# EAGLE design GBASP USB-C (EAGLE 6.2)
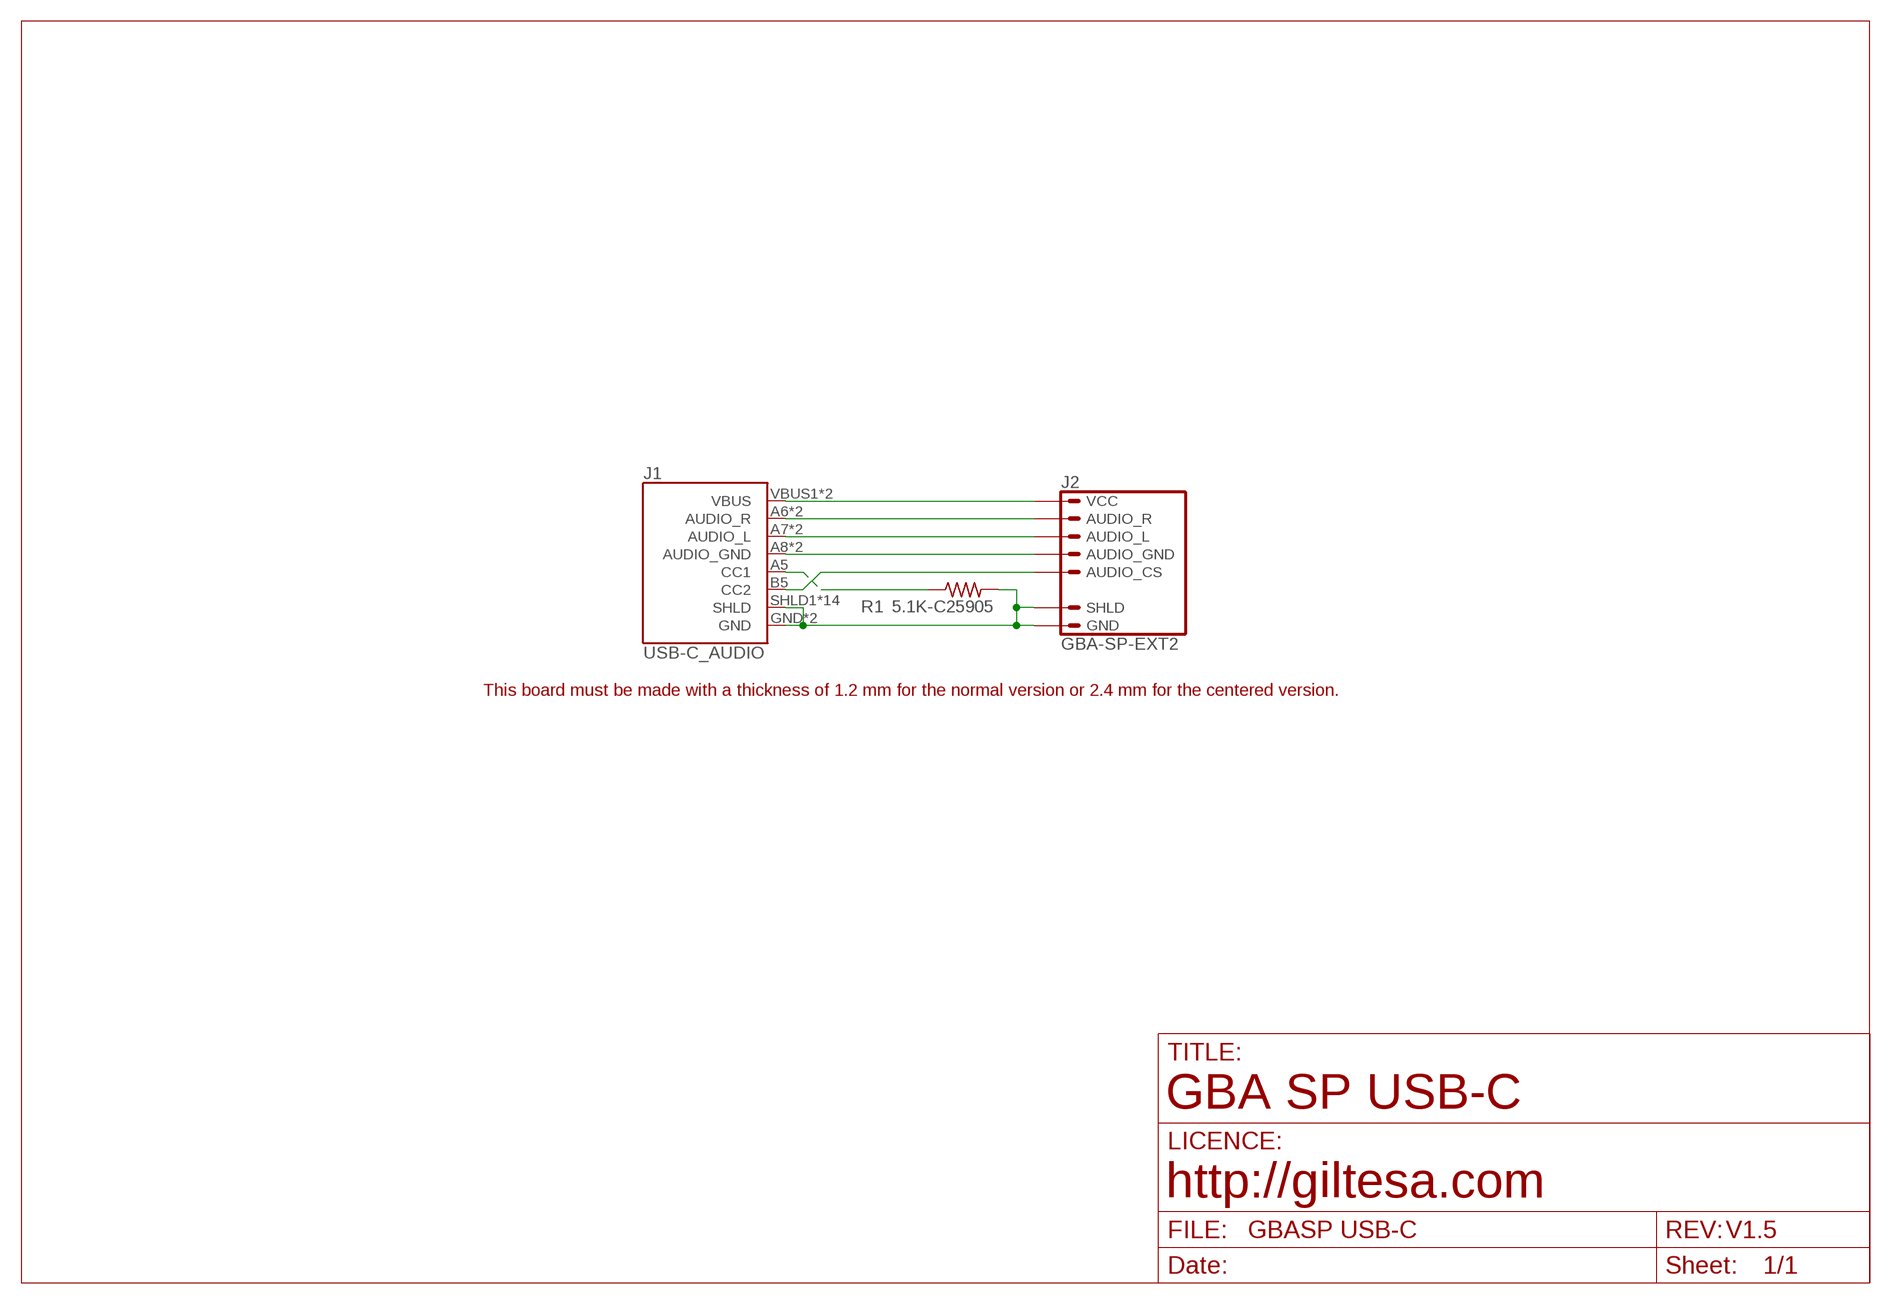
[diagram p0: schematic, sheet 1]

## Parts
J1  USB-C_AUDIO  USB-C_POWER_AUDIOGBASP_DRILL  [USB-C_16P_3SHLD_DRILL]
J2  GBA-SP-EXT2  GBA-SP-EXT2_1  [GBA-SP-EXT2_1]
R1  5.1K-C25905  R0402  [R0402]

## Nets
AUDIO_GND: J1.A8(AUDIO_GND) J1.B8(AUDIO_GND) J2.AUDIO_GND
AUDIO_L: J1.A7(AUDIO_L) J1.B7(AUDIO_L) J2.AUDIO_L
AUDIO_R: J1.A6(AUDIO_R) J1.B6(AUDIO_R) J2.AUDIO_R
CC2: J1.B5(CC2) J2.AUDIO_CS
GND: J1.GND J1.GND2(GND) J1.SHLD1(SHLD) J1.SHLD1_2(SHLD) J1.SHLD3(SHLD) J1.SHLD3_2(SHLD) J1.SHLD4(SHLD) J1.SHLD4_2(SHLD) J1.SHLD5(SHLD) J1.SHLD5_2(SHLD) J1.SHLD6(SHLD) J1.SHLD6_2(SHLD) J1.SHLD7(SHLD) J1.SHLD7_2(SHLD) J1.SHLD8(SHLD) J1.SHLD8_2(SHLD) J2.GND J2.SHLD1(SHLD) J2.SHLD2(SHLD) J2.SHLD3(SHLD) J2.SHLD4(SHLD) R1.2
N$7: J1.A5(CC1) R1.1
VCC: J1.VBUS1(VBUS) J1.VBUS2(VBUS) J2.VCC

## Notes on the sheet
- This board must be made with a thickness of 1.2 mm for the normal version or 2.4 mm for the centered version.
- GBA SP USB-C
- http://giltesa.com
- V1.5

## Library data of the parts
J1 = ,giltesa:USB-C_POWER_AUDIO
J2 = ,giltesa:GBA-SP-EXT2
R1 = ,giltesa:R0402

## Net classes
1 power: width 0.61 mm, drill 0.406 mm, clearance 0.203 mm
2 gnd: width 0.305 mm, drill 0.406 mm, clearance 0.203 mm
3 power usb: width 0.508 mm, drill 0.406 mm, clearance 0.203 mm

## Board
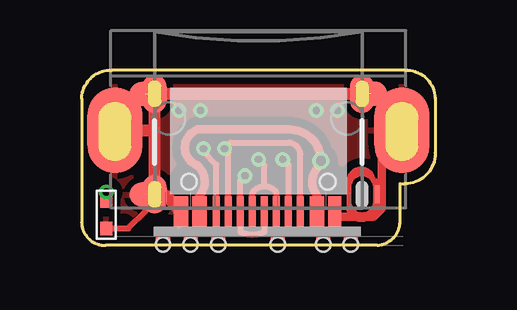
[diagram p1: board, top side]
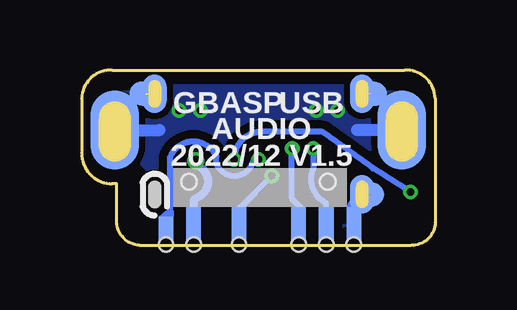
[diagram p2: board, bottom side, seen from below]

Size 14.73 x 7.3 mm. Coordinates in mm from the lower left corner, seen from the top.
Outline: 12.32,0 arc90 13.27,1.07 13.27,2.57 13.46,2.57 arc90 14.73,3.84 14.73,6.12 arc90 13.46,7.3 1.27,7.3 arc90 0,6.12 0,0.94 arc90 1,0 12.32,0
Copper layers (1*16): Top 0.035mm / dielectric 1.6mm / Bottom 0.035mm
Design rules: minimum track width 6mil, minimum drill 12mil, track to track 6mil, track to pad 6mil, pad to pad 6mil, via to via 8mil, smd to smd 0mil, copper to edge 20mil, drill to drill 10mil, minimum pad ring 6mil, minimum via ring 6mil, stop-mask expansion 0mil, vias tented up to drill 100mil, thermal gap 10mil
tRestrict: 6 lines
bRestrict: area 3,0.7 to 3.1,1.2; 2 lines

### Footprints (pad centres in the part's own frame; a part is rotated, then mirrored left to right if it is on the bottom)
USB-C_16P_3SHLD_DRILL = smd 0.3 x 1.27: A5 -1.25,0.132; A6 -0.25,0.132; A7 0.25,0.132; A8 1.25,0.132; B5 1.75,0.132; B6 0.75,0.132; B7 -0.75,0.132; B8 -1.75,0.132 | smd 0.533 x 1.27: GND -3.184,0.132 | smd 0.6 x 1.27: GND2 3.225,0.132; VBUS1 -2.45,0.132; VBUS2 2.45,0.132 | smd 0.2 x 0.75: SHLD1 -4.95,-0.57; SHLD1_2 -4.95,-0.57 | smd 1 x 1.6: SHLD3 4.32,-0.57; SHLD5 4.32,-4.761; SHLD7 -4.32,-4.764 | smd 1.346 x 1: SHLD3_2 4.688,-0.567; SHLD5_2 4.688,-4.758; SHLD7_2 -4.688,-4.768 | smd 1 x 1.6 bottom: SHLD4 4.32,-0.57; SHLD6 4.32,-4.761; SHLD8 -4.32,-4.764 | smd 1.346 x 1 bottom: SHLD4_2 4.561,-0.567; SHLD6_2 4.688,-4.758; SHLD8_2 -4.688,-4.768 | hole 0.635: -2.89,-1.1; 2.89,-1.1 | hole 0.432: -4.32,-0.878; -4.32,-0.269; -4.32,-0.472; -4.32,-0.675; -4.32,-0.37; -4.32,-0.777; -4.32,-0.574
GBA-SP-EXT2_1 = smd 0.61 x 1.651 bottom: AUDIO_CS -2.826,-0.797; AUDIO_GND -1.676,-0.797; AUDIO_R 0.806,-0.797; GND -3.976,-0.797; VCC 2.698,-0.797 | smd 0.61 x 0.457: AUDIO_CS1 -2.826,-1.394; AUDIO_GND1 -1.676,-1.394; AUDIO_L1 3.848,-1.394; AUDIO_R1 0.806,-1.394; GND1 -3.976,-1.394; VCC1 2.698,-1.394 | smd 0.61 x 1.27 bottom: AUDIO_L 3.848,-0.987 | smd 2.286 x 3.556: SHLD1 -5.982,3.251; SHLD3 5.982,3.251 | smd 2.032 x 3.302 bottom: SHLD2 -5.982,3.251; SHLD4 5.982,3.251 | hole 0.6: -3.976,-1.516; -2.826,-1.516; -1.676,-1.516; 0.806,-1.516; 2.698,-1.516; 3.848,-1.516
R0402 = smd 0.559 x 0.5: 1 -0.567,0; 2 0.567,0

### Placement (x,y rotation side)
J1  7.37,1.55 180 top
J2  7.37,1.55 0 top
R1  1.03,1.27 270 top

### Tracks (layer width: path | path; a pad name or v marks a point on that pad's centre or on a via)
AUDIO_GND  (via drill 0.3)
  Top 0.254: J1.A8 6.12,3.87 v5.96,4.03 6.21,4.28 8.64,4.28 arc-80 9.12,3.8 J1.B8
  Bottom 0.254: 5.57,1.15 J2.AUDIO_GND 5.57,1.53 5.97,1.93 5.97,4.01 v5.96,4.03
AUDIO_L  (via drill 0.3)
  Top 0.127: 7.62,2.46 7.39,2.46 7.11,2.18
  Top 0.254: J1.A7 7.11,2.18 arc-110 8.13,2.18 8.13,1.42 J1.B7 | 7.62,2.46 7.62,3.33 v7.37,3.58
  Bottom 0.254: J2.AUDIO_L 11.32,0.43 11.04,0.99 11.04,3.71 arc130 9.12,3.71 9.12,3.45 arc-150 7.62,3.45 v7.37,3.58
AUDIO_R  (via drill 0.3)
  Top 0.254: J1.B6 6.62,0.86 | 6.62,0.86 6.62,0.56 arc50 7.62,0.56 J1.A6 | 6.62,0.86 6.6,0.93 6.6,2.69 v6.81,2.9
  Bottom 0.254: J2.AUDIO_R 8.17,1.53 v6.81,2.9
CC2  (via drill 0.3)
  Top 0.254: J1.B5 5.62,3.36 5.08,3.9 v5.08,4.03
  Bottom 0.254: J2.AUDIO_CS 4.54,1.77 arc90 5.08,3.2 v5.08,4.03
GND  (via drill 0.3)  (9 unrouted)
  Top 0.254: R1.2 1.95,0.7 2.67,1.42 2.67,2.1 J1.SHLD4_2
  Top 0.356: J1.GND 10.55,1.31 10.62,1.24 10.62,1.19 12.14,1.19 12.5,1.55 12.5,2.01 | 12.5,2.01 12.5,5.21 | 12.5,5.21 12.5,5.87 11.93,6.32 | J2.SHLD4 12.9,4.8 12.5,5.21 | J1.SHLD1_2 12.38,2.12 12.5,2.01
  Top 0.406: J1.SHLD4 J1.SHLD3_2 J1.SHLD4_2 | 2.8,6.31 J1.SHLD6 | 11.93,6.32 J1.SHLD7
  Top 0.508: J1.SHLD6 3.22,6.12 | 11.51,6.12 arc90 J1.SHLD7 J1.SHLD6 | 3.05,4.85 J1.SHLD4 3.44,2.12 J1.GND2 | 3.05,4.85 J1.SHLD6 | J2.SHLD2 2.99,4.8 3.05,4.85
  Bottom 0.508: J2.GND 3.42,1.62 J1.SHLD4 | J2.SHLD2 3.25,4.8 | J2.SHLD4 11.48,4.8
  other vias: 4.95,5.61 9.78,5.61 10.67,5.61 4.06,5.61
  pour Top (isolate 0.356): -0.39,7.4 15.12,7.4 15.12,-0.49 -0.39,-0.49
  pour Bottom (isolate 0.356): -0.39,7.4 15.12,7.4 15.12,-0.49 -0.39,-0.49
N$7  (via drill 0.3)
  Top 0.254: J1.A5 8.64,1.42 8.64,3.33 v8.38,3.58 | R1.1 v1.03,2.22
  Bottom 0.254: v1.03,2.22 2.59,3.2 4.7,4.72 7.24,4.72 arc-90 v8.38,3.58
VCC  (via drill 0.41)
  Top 0.356: J1.VBUS2 4.87,1.44 4.98,1.55 4.83,1.55 4.83,1.8 4.85,1.96 4.98,2.16 arc80 4.85,3.3 4.83,3.33 arc-140 4.83,4.83 8.66,4.83 arc-90 v9.97,3.52 9.91,3.3 arc80 9.73,2.21 9.84,2 J1.VBUS1
  Bottom 0.356: J2.VCC 10.06,1.91 9.75,2.08 arc-120 9.88,3.3 v9.97,3.52
  Bottom 0.406: 10.1,0.78 J2.VCC

### Text on the board
bPlace: USB | GBASP | AUDIO | 2022/12 V1.5